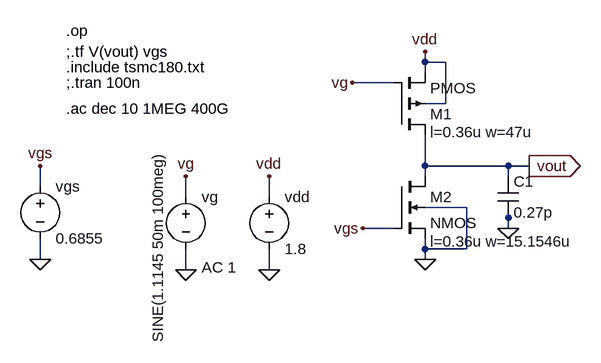
[diagram p0: schematic cs pmos current source load.asc]
cs pmos current source load.asc, the LTspice schematic file:
Version 4
SHEET 1 880 680
WIRE 400 -16 400 -32
WIRE 432 -16 400 -16
WIRE 400 0 400 -16
WIRE 352 16 288 16
WIRE 432 48 432 -16
WIRE 432 48 400 48
WIRE 400 144 400 96
WIRE 528 144 400 144
WIRE 560 144 528 144
WIRE 400 160 400 144
WIRE 528 160 528 144
WIRE -192 176 -192 144
WIRE 32 192 32 160
WIRE 160 192 160 160
WIRE 464 208 400 208
WIRE 528 224 528 208
WIRE 352 240 304 240
WIRE 528 240 528 224
WIRE 400 272 400 256
WIRE 464 272 464 208
WIRE 464 272 400 272
WIRE -192 288 -192 256
WIRE 400 288 400 272
WIRE 32 304 32 272
WIRE 160 304 160 272
FLAG 160 304 0
FLAG 160 160 vdd
FLAG 400 -32 vdd
FLAG 32 304 0
FLAG 32 160 vg
FLAG 288 16 vg
FLAG 560 144 vout
IOPIN 560 144 Out
FLAG 400 288 0
FLAG 304 240 vgs
FLAG -192 288 0
FLAG -192 144 vgs
FLAG 528 240 0
SYMBOL pmos4 352 96 M180
WINDOW 123 56 4 Left 2
SYMATTR Value2 l=0.36u w=47u
SYMATTR InstName M1
SYMBOL voltage 160 176 R0
WINDOW 123 0 0 Left 0
WINDOW 39 0 0 Left 0
SYMATTR InstName vdd
SYMATTR Value 1.8
SYMBOL voltage 32 176 R0
WINDOW 123 24 124 Left 2
WINDOW 39 0 0 Left 0
WINDOW 3 -43 -55 VRight 2
SYMATTR Value2 AC 1
SYMATTR Value SINE(1.1145 50m 100meg)
SYMATTR InstName vg
SYMBOL nmos4 352 160 R0
WINDOW 123 56 100 Left 2
SYMATTR Value2 l=0.36u w=15.1546u
SYMATTR InstName M2
SYMBOL voltage -192 160 R0
WINDOW 123 0 0 Left 0
WINDOW 39 0 0 Left 0
SYMATTR InstName vgs
SYMATTR Value 0.6855
SYMBOL cap 512 160 R0
SYMATTR InstName C1
SYMATTR Value 0.27p
TEXT -152 -8 Left 2 !.include tsmc180.txt
TEXT -152 -64 Left 2 !.op
TEXT -152 -32 Left 2 !;.tf V(vout) vgs
TEXT -152 16 Left 2 !;.tran 100n
TEXT -152 56 Left 2 !.ac dec 10 1MEG 400G

The netlist it stands for:
* cs pmos current source load.asc
M1 vout vg vdd vdd PMOS l=0.36u w=47u
vdd vdd 0 1.8
vg vg 0 SINE(1.1145 50m 100meg) AC 1
M2 vout vgs 0 0 NMOS l=0.36u w=15.1546u
vgs vgs 0 0.6855
C1 vout 0 0.27p
.model NMOS NMOS
.model PMOS PMOS
.lib standard.mos
.include tsmc180.txt
.op
;.tf V(vout) vgs
;.tran 100n
.ac dec 10 1MEG 400G
.backanno
.end